# Altium project LC_LPF_PI.PrjPcb
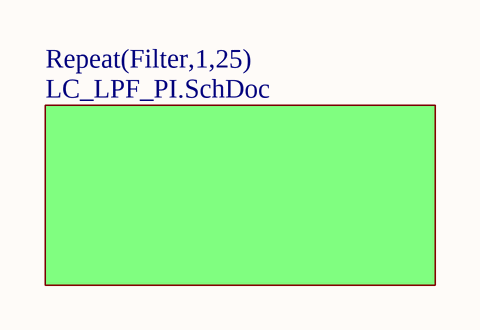
[diagram p0: Main.SchDoc]
2 sheets, 125 parts. Net scope: hierarchical (ports join the sheet entries above them; power ports are global).
Board file: LC_LPF_PI.PcbDoc
Sheets:
  Main.SchDoc
    Filter1 = LC_LPF_PI.SchDoc
    Filter2 = LC_LPF_PI.SchDoc
    Filter3 = LC_LPF_PI.SchDoc
    Filter4 = LC_LPF_PI.SchDoc
    Filter5 = LC_LPF_PI.SchDoc
    Filter6 = LC_LPF_PI.SchDoc
    Filter7 = LC_LPF_PI.SchDoc
    Filter8 = LC_LPF_PI.SchDoc
    Filter9 = LC_LPF_PI.SchDoc
    Filter10 = LC_LPF_PI.SchDoc
    Filter11 = LC_LPF_PI.SchDoc
    Filter12 = LC_LPF_PI.SchDoc
    Filter13 = LC_LPF_PI.SchDoc
    Filter14 = LC_LPF_PI.SchDoc
    Filter15 = LC_LPF_PI.SchDoc
    Filter16 = LC_LPF_PI.SchDoc
    Filter17 = LC_LPF_PI.SchDoc
    Filter18 = LC_LPF_PI.SchDoc
    Filter19 = LC_LPF_PI.SchDoc
    Filter20 = LC_LPF_PI.SchDoc
    Filter21 = LC_LPF_PI.SchDoc
    Filter22 = LC_LPF_PI.SchDoc
    Filter23 = LC_LPF_PI.SchDoc
    Filter24 = LC_LPF_PI.SchDoc
    Filter25 = LC_LPF_PI.SchDoc

## Sheet Main.SchDoc
size A; DocumentNumber: 2; SheetNumber: 1; SheetTotal: 2

### Sub-sheets
Repeat(Filter,1,25) = LC_LPF_PI.SchDoc: no entries

## Sheet LC_LPF_PI.SchDoc
size A; DocumentNumber: 1; SheetNumber: 2; SheetTotal: 2
Used 25 times, as channels Filter1, Filter2, Filter3, Filter4, Filter5, Filter6, Filter7, Filter8, Filter9, Filter10, Filter11, Filter12, Filter13, Filter14, Filter15, Filter16, Filter17, Filter18, Filter19, Filter20, Filter21, Filter22, Filter23, Filter24, Filter25. Parts and nets are listed once, with the designators drawn on the sheet.
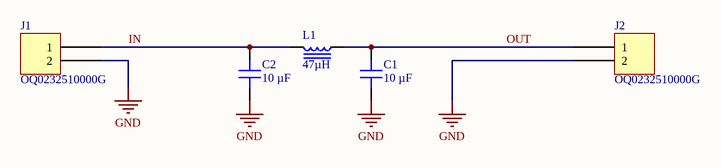
[diagram p1: LC_LPF_PI.SchDoc]

### Parts
C1  10 µF  [CAP 0603_1608]
C2  10 µF  [CAP 0603_1608]
J1  OQ0232510000G  [FCI 06-381-2PIN]
J2  OQ0232510000G  [FCI 06-381-2PIN]
L1  47µH  [IND 0603_1608 RF WW]

### Nets
GND: C1.1 C2.1 J1.2 J2.2
IN: C2.2 J1.1 L1.2  [project net IN_2]
OUT: C1.2 J2.1 L1.1  [project net OUT_2]

### Channels
Filter1: designators end in _Filter1
Filter2: designators end in _Filter2
Filter3: designators end in _Filter3
Filter4: designators end in _Filter4
Filter5: designators end in _Filter5
Filter6: designators end in _Filter6
Filter7: designators end in _Filter7
Filter8: designators end in _Filter8
Filter9: designators end in _Filter9
Filter10: designators end in _Filter10
Filter11: designators end in _Filter11
Filter12: designators end in _Filter12
Filter13: designators end in _Filter13
Filter14: designators end in _Filter14
Filter15: designators end in _Filter15
Filter16: designators end in _Filter16
Filter17: designators end in _Filter17
Filter18: designators end in _Filter18
Filter19: designators end in _Filter19
Filter20: designators end in _Filter20
Filter21: designators end in _Filter21
Filter22: designators end in _Filter22
Filter23: designators end in _Filter23
Filter24: designators end in _Filter24
Filter25: designators end in _Filter25

### Library data of the parts
C1 C2 = MD0603BW106M100NHT-EM: CAP CER 10UF 10V X5R 0603; manufacturer: Knowles Novacap; Tolerance: ±20%; Part Number: MD0603BW106M100NHT-EM; Value: 10 µF; Applications: Medical, Non-Critical; Capacitance: 10 µF; componentlink1description: Datasheet; componentlink1url: https://mm.digikey.com/Volume0/opasdata/d220001/medias/docus/5546/MD Series R3.pdf; componentlink2description: DigiKey Link; componentlink2url: https://www.digikey.com/en/products/detail/knowles-novacap/MD0603BW106M100NHT-EM/21406876; Device Package: 0603 (1608 Metric); lastupdated: 02/11/2023 19:09:18; Lifecycle Status: Active; Minimum Order: 1; Mounting Type: Surface Mount, MLCC; Operating Temperature: -55°C ~ 85°C; Package / Case: 0603 (1608 Metric); packaging: TapeAndReel; partid: 56748; price: 0.24; series: MD; Supplier 1: DigiKey; Supplier Part Number 1: 1763-MD0603BW106M100NHT-EMCT-ND; Temperature Coefficient: X5R; Voltage - Rated: 10V
J1 J2 = OQ0232510000G: TERM BLOCK HDR 2POS 90DEG 3.81MM; Manufacturer: Amphenol Anytek; Current - UL: 10A; Header Orientation: 90°, Right Angle; Number of Levels: 1; Number of Positions: 2; Pitch: 0.150" (3.81mm); Voltage - UL: 300V; Part Number: OQ0232510000G; Color: Green; ComponentLink1Description: Datasheet; ComponentLink1URL: http://portal.fciconnect.com/Comergent//fci/drawing/oqxx32x100j0g.pdf; ComponentLink2Description: DigiKey Link; ComponentLink2URL: //digikey.com/product-detail/en/amphenol-anytek/OQ0232510000G/609-3819-ND/2261255; Contact Mating Finish: Tin; LastUpdated: 16/12/2019 19:14:30; Lifecycle Status: 0; Minimum Order: 1; Mounting Type: Through Hole; Operating Temperature: -40°C ~ 115°C; Packaging: Bulk; Part Status: Active; Positions Per Level: 2; Price: 0.49; Series: 06-381; Supplier 1: DigiKey; Supplier Part Number 1: 609-3819-ND; Termination Style: Solder; Type: Header, Male Pins, Shrouded (4 Side)
L1 = L0603B470MPWFT: INDUCTORPOWER LINE 0603 47H 20%; Manufacturer: KEMET; Current Rating (Amps): 90mA; DC Resistance (DCR): 5.8Ohm; Frequency - Self Resonant: 11MHz; Inductance Frequency - Test: 2.52MHz; Material - Core: Ferrite; Shielding: Unshielded; Type: Wirewound; Part Number: L0603B470MPWFT; ComponentLink1Description: Datasheet; ComponentLink1URL: https://api.kemet.com/component-edge/download/datasheet/L0603B470MPWFT.pdf; ComponentLink2Description: DigiKey Link; ComponentLink2URL: http://digikey.com/product-detail/en/kemet/L0603B470MPWFT/399-17776-1-ND/8601439; Device Package: 0603 (1608 Metric); Height - Seated (Max): 0.035" (0.90mm); Inductance: 47µH; LastUpdated: 06/09/2020 11:05:20; Lifecycle Status: Active; Minimum Order: 1; Mounting Type: Surface Mount; Operating Temperature: -40°C ~ 105°C; Package / Case: 0603 (1608 Metric); Packaging: TapeAndReel; PartId: 1309; Part Status: Active; Price: 0.14; Series: L-PWF; Size / Dimension: 0.063" L x 0.031" W (1.60mm x 0.80mm); Supplier 1: DigiKey; Supplier Part Number 1: 399-17776-1-ND; Supplier Device Package: 0603 (1608 Metric); Tolerance: ±20%; Value: 47µH

## Nets that join several sheets
GND: Filter1 (C1_Filter1.1 C2_Filter1.1 J1_Filter1.2 J2_Filter1.2), Filter2 (C1_Filter2.1 C2_Filter2.1 J1_Filter2.2 J2_Filter2.2), Filter3 (C1_Filter3.1 C2_Filter3.1 J1_Filter3.2 J2_Filter3.2), Filter4 (C1_Filter4.1 C2_Filter4.1 J1_Filter4.2 J2_Filter4.2), Filter5 (C1_Filter5.1 C2_Filter5.1 J1_Filter5.2 J2_Filter5.2), Filter6 (C1_Filter6.1 C2_Filter6.1 J1_Filter6.2 J2_Filter6.2), Filter7 (C1_Filter7.1 C2_Filter7.1 J1_Filter7.2 J2_Filter7.2), Filter8 (C1_Filter8.1 C2_Filter8.1 J1_Filter8.2 J2_Filter8.2), Filter9 (C1_Filter9.1 C2_Filter9.1 J1_Filter9.2 J2_Filter9.2), Filter10 (C1_Filter10.1 C2_Filter10.1 J1_Filter10.2 J2_Filter10.2), Filter11 (C1_Filter11.1 C2_Filter11.1 J1_Filter11.2 J2_Filter11.2), Filter12 (C1_Filter12.1 C2_Filter12.1 J1_Filter12.2 J2_Filter12.2), Filter13 (C1_Filter13.1 C2_Filter13.1 J1_Filter13.2 J2_Filter13.2), Filter14 (C1_Filter14.1 C2_Filter14.1 J1_Filter14.2 J2_Filter14.2), Filter15 (C1_Filter15.1 C2_Filter15.1 J1_Filter15.2 J2_Filter15.2), Filter16 (C1_Filter16.1 C2_Filter16.1 J1_Filter16.2 J2_Filter16.2), Filter17 (C1_Filter17.1 C2_Filter17.1 J1_Filter17.2 J2_Filter17.2), Filter18 (C1_Filter18.1 C2_Filter18.1 J1_Filter18.2 J2_Filter18.2), Filter19 (C1_Filter19.1 C2_Filter19.1 J1_Filter19.2 J2_Filter19.2), Filter20 (C1_Filter20.1 C2_Filter20.1 J1_Filter20.2 J2_Filter20.2), Filter21 (C1_Filter21.1 C2_Filter21.1 J1_Filter21.2 J2_Filter21.2), Filter22 (C1_Filter22.1 C2_Filter22.1 J1_Filter22.2 J2_Filter22.2), Filter23 (C1_Filter23.1 C2_Filter23.1 J1_Filter23.2 J2_Filter23.2), Filter24 (C1_Filter24.1 C2_Filter24.1 J1_Filter24.2 J2_Filter24.2), Filter25 (C1_Filter25.1 C2_Filter25.1 J1_Filter25.2 J2_Filter25.2)